# Altium project IEEE Plasma Speaker.PrjPcb
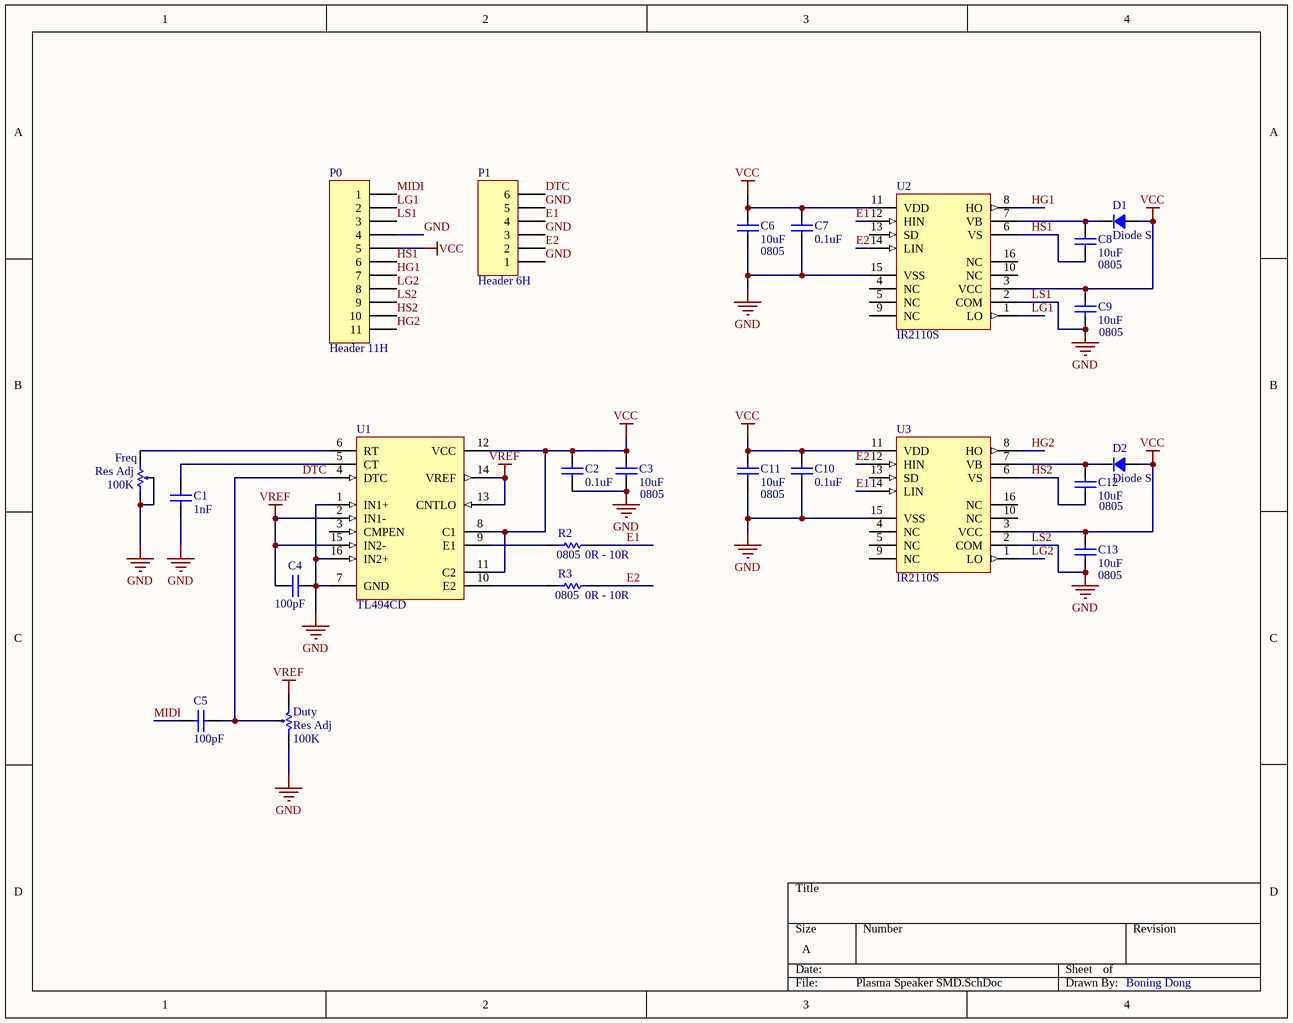
[diagram p0: Plasma Speaker SMD.SchDoc]
1 sheet, 24 parts. Net scope: global (net labels, ports and power ports of the same name join across sheets).
Board file: PCB.PcbDoc

## Sheet Plasma Speaker SMD.SchDoc
size A

### Parts
C1  value 1nF  [D0603]  (hidden comment: 0603)
C2  value 0.1uF  [D0603]  (hidden comment: 0603)
C3  0805  value 10uF  [D0805]
C4  value 100pF  [D0603]  (hidden comment: 0603)
C5  value 100pF  [D0603]  (hidden comment: 0603)
C6  0805  value 10uF  [D0805]
C7  value 0.1uF  [D0603]  (hidden comment: 0603)
C8  0805  value 10uF  [D0805]
C9  0805  value 10uF  [D0805]
C10  value 0.1uF  [D0603]  (hidden comment: 0603)
C11  0805  value 10uF  [D0805]
C12  0805  value 10uF  [D0805]
C13  0805  value 10uF  [D0805]
D1  Diode S  [DO-214]
D2  Diode S  [DO-214]
Duty  Res Adj  value 100K  [RES-3362P]
Freq  Res Adj  value 100K  [RES-3362P]
P0  Header 11H  [HDR1X11H]
P1  Header 6H  [HDR1X6H]
R2  0805  value 0R - 10R  [D0805]
R3  0805  value 0R - 10R  [D0805]
U1  TL494CD  [751B-05_N]
U2  IR2110S  [SOIC16_N]
U3  IR2110S  [SOIC16_N]

### Nets
GND: C1.1 C2.1 C3.1 C4.1 C6.1 C7.1 C9.1 C10.1 C11.1 C13.1 Duty.3 Freq.2 Freq.3 P0.3 P0.4 P0.9 P1.1 P1.3 P1.5 U1.1(IN1+) U1.7(GND) U1.16(IN2+) U2.2(COM) U2.15(VSS) U3.2(COM) U3.15(VSS)  [also labelled LS1, LS2]
VCC: C2.2 C3.2 C6.2 C7.2 C9.2 C10.2 C11.2 C13.2 D1.1 D2.1 P0.5 U1.8(C1) U1.11(C2) U1.12(VCC) U2.3(VCC) U2.11(VDD) U3.3(VCC) U3.11(VDD)
VREF: C4.2 Duty.1 U1.2(IN1-) U1.13(CNTLO) U1.14(VREF) U1.15(IN2-)
DTC: C5.2 Duty.2 P1.6 U1.4(DTC)
E1: P1.4 R2.1 U2.12(HIN) U3.14(LIN)
E2: P1.2 R3.1 U2.14(LIN) U3.12(HIN)
HG1: P0.7 U2.8(HO)
HG2: P0.11 U3.8(HO)
HS1: C8.1 P0.6 U2.6(VS)
HS2: C12.1 P0.10 U3.6(VS)
LG1: P0.2 U2.1(LO)
LG2: P0.8 U3.1(LO)
MIDI: C5.1 P0.1
NetC1_2: C1.2 U1.5(CT)
NetC8_2: C8.2 D1.2 U2.7(VB)
NetC12_2: C12.2 D2.2 U3.7(VB)
NetFreq_1: Freq.1 U1.6(RT)
NetR2_2: R2.2 U1.9(E1)
NetR3_2: R3.2 U1.10(E2)

Not connected (* = marked no-connect by the designer): U1 3(CMPEN); U2 4(NC) 5(NC) 9(NC) 10(NC) 13(SD) 16(NC); U3 4(NC) 5(NC) 9(NC) 10(NC) 13(SD) 16(NC)

### Notes on the sheet
- Boning Dong

### Library data of the parts
C1-C13 = Cap: Capacitor; Published: 8-Jun-2000; LatestRevisionDate: 17-Jul-2002; LatestRevisionNote: Re-released for DXP Platform.; PackageReference: RAD-0.3; Publisher: Altium Limited; PackageDescription: Radial Cap, Thru-Hole; 2 Leads; 0.3 in Pin Spacing
D1 D2 = Diode S: Zener Diode; Published: 8-Jun-2000; LatestRevisionDate: 17-Jul-2002; LatestRevisionNote: Re-released for DXP Platform.; PackageReference: DIODE-0.7; Publisher: Altium Limited; PackageDescription: Diode, Thru-Hole; 2 Leads; 0.7 in Pin Spacing
Duty Freq = Res Adj: Resistor; Published: 8-Jun-2000; LatestRevisionDate: 17-Jul-2002; LatestRevisionNote: Re-released for DXP Platform.; PackageReference: AXIAL-0.3; Publisher: Altium Limited; PackageDescription: Axial Device, Thru-Hole; 2 Leads; 0.3 in Pin Spacing
P0 = Header 11H: Header, 11-Pin, Right Angle; LatestRevisionDate: 17-Jul-2002; LatestRevisionNote: Re-released for DXP Platform.; Publisher: Altium Limited
P1 = Header 6H: Header, 6-Pin, Right Angle; LatestRevisionDate: 17-Jul-2002; LatestRevisionNote: Re-released for DXP Platform.; Publisher: Altium Limited
R2 R3 = Res1: Resistor; Published: 8-Jun-2000; LatestRevisionDate: 17-Jul-2002; LatestRevisionNote: Re-released for DXP Platform.; PackageReference: AXIAL-0.3; Publisher: Altium Limited; PackageDescription: Axial Device, Thru-Hole; 2 Leads; 0.3 in Pin Spacing
U1 = TL494CD: Switchmode Pulse Width Modulation Control Circuit; Published: 15-Apr-2002; LatestRevisionDate: 13-Apr-2006; LatestRevisionNote: IPC-7351 Footprint Added.; DatasheetVersion: 1996; PackageVersion: Oct-1999; PackageReference: 751B-05; Publisher: Altium Limited; PackageDescription: 16-Pin Small Outline Integrated Circuit 1.27 mm Pitch; Code_JEDEC: MS-012-AC; Code_IPC: SOIC127P600-16; ComponentLink1Description: Manufacturer Link; ComponentLink1URL: http://www.onsemi.com/site/products/taxonomy/0,4438,503,00.html; ComponentLink2Description: Datasheet; ComponentLink2URL: http://www.onsemi.com/pub/Collateral/TL494-D.PDF
U2 U3 = IR2110S: High and Low Side Driver; Note: Pins 4, 5, 9, 10 and 16 are not connected; Published: 8-Jun-2000; LatestRevisionDate: 13-Apr-2006; LatestRevisionNote: IPC-7351 Footprint Added.; DatasheetVersion: PD60147J; PackageReference: SOIC16; Publisher: Altium Limited; PackageDescription: 16-Pin Small Outline Integrated Circuit 1.27 mm Pitch; Code_JEDEC: MS-013-AA; Code_IPC: SOIC127P1030-16; ComponentLink1Description: Manufacturer Link; ComponentLink1URL: http://www.irf.com/; ComponentLink2Description: Datasheet; ComponentLink2URL: http://www.irf.com/product-info/datasheets/data/ir2110.pdf